# EAGLE design 4BitCounter (EAGLE 7.6.0)
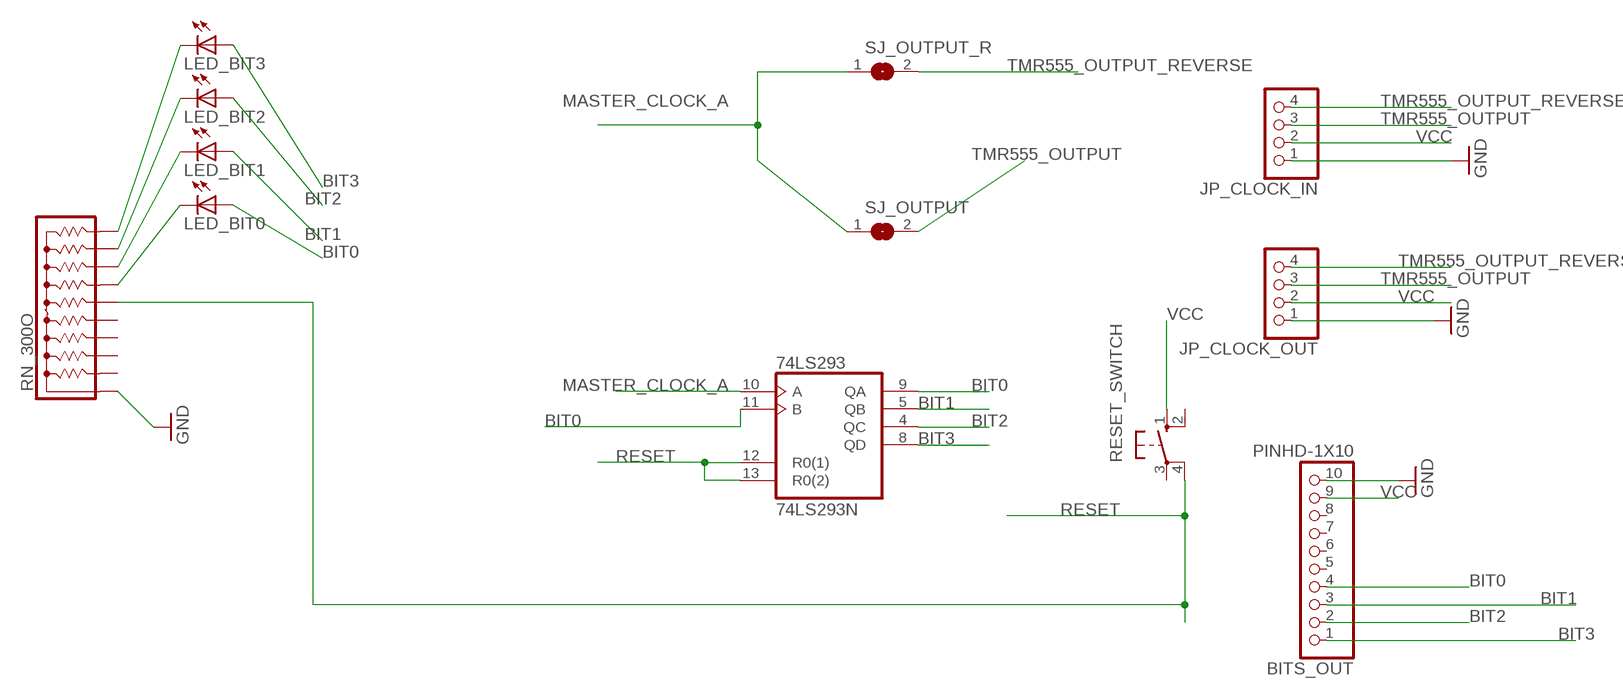
[diagram p0: schematic, sheet 1]

## Parts
74LS293  74LS293N  [DIL14]
BITS_OUT  PINHD-1X10  [1X10-BIG]
JP_CLOCK_IN  PINHD-1X4  [1X04]
JP_CLOCK_OUT  PINHD-1X4  [1X04]
LED_BIT0  LEDSMT1206  [1206]
LED_BIT1  LEDSMT1206  [1206]
LED_BIT2  LEDSMT1206  [1206]
LED_BIT3  LEDSMT1206  [1206]
RESET_SWITCH  10-XX  [B3F-10XX]
RN_300O  4610X  [SIP10]
SJ_OUTPUT  SOLDERJUMPERREFLOW  [SOLDERJUMPER_REFLOW]
SJ_OUTPUT_R  SOLDERJUMPERREFLOW  [SOLDERJUMPER_REFLOW]

## Nets
BIT0: 74LS293.9(QA) 74LS293.11(B) BITS_OUT.4 LED_BIT0.A
BIT1: 74LS293.5(QB) BITS_OUT.3 LED_BIT1.A
BIT2: 74LS293.4(QC) BITS_OUT.2 LED_BIT2.A
BIT3: 74LS293.8(QD) BITS_OUT.1 LED_BIT3.A
GND: BITS_OUT.10 JP_CLOCK_IN.1 JP_CLOCK_OUT.1 RN_300O.1
MASTER_CLOCK_A: 74LS293.10(A) SJ_OUTPUT.1 SJ_OUTPUT_R.1
N$1: LED_BIT1.C RN_300O.8
N$2: LED_BIT0.C RN_300O.7
N$3: LED_BIT2.C RN_300O.9
N$4: LED_BIT3.C RN_300O.10
RESET: 74LS293.12(R0(1)) 74LS293.13(R0(2)) RESET_SWITCH.4(P1) RN_300O.6
TMR555_OUTPUT: JP_CLOCK_IN.3 JP_CLOCK_OUT.3 SJ_OUTPUT.2
TMR555_OUTPUT_REVERSE: JP_CLOCK_IN.4 JP_CLOCK_OUT.4 SJ_OUTPUT_R.2
VCC: BITS_OUT.9 JP_CLOCK_IN.2 JP_CLOCK_OUT.2 RESET_SWITCH.1(S)
Unconnected: BITS_OUT.5 BITS_OUT.6 BITS_OUT.7 BITS_OUT.8 RESET_SWITCH.2(S1) RESET_SWITCH.3(P) RN_300O.2 RN_300O.3 RN_300O.4 RN_300O.5

## Power pins joined to a net without a drawn wire
GND: 74LS293.7(GND)
VCC: 74LS293.14(VCC)

## Library data of the parts
74LS293 = 74xx-eu:74*293: Decade and 4-bit BINARY COUNTER
BITS_OUT = adafruit:PINHD-1X10: Pin header 1x10 0.1" spacing With round pins
JP_CLOCK_IN JP_CLOCK_OUT = pinhead:PINHD-1X4: PIN HEADER
LED_BIT0 LED_BIT1-LED_BIT3 = adafruit:LED: LED OSRAM: - CHIPLED LG R971, LG N971, LY N971, LG Q971, LY Q971, LO R971, LY R971 LH N974, LH R974 LS Q976, LO Q976, LY Q976 LO Q996 - Hyper CHIPLED LW Q18S LB Q993, LB Q99A, LB R99A - SideLED LS A670, LO A670, LY A670, LG A670, LP A670 LB A673, LV A673, LT A673, LW A673 LH A674 LY A675 LS A676, LA A676, LO A676, LY A676, LW A676 LS A679, LY A679, LG A679 - Hyper Micro SIDELED® LS Y876, LA Y876, LO Y876, LY Y876 LT Y87S - SmartLED LW L88C, LW L88S LB L89C, LB L89S, LG L890 LS L89K, LO L89K, LY L89K LS L896, LA L896, LO L896, LY L896 - TOPLED LS T670, LO T670, LY T670, LG T670, LP T670 LSG T670, LSP T670, LSY T670, LOP T670, LYG T670 LG T671, LOG T671, LSG T671 LB T673, LV T673, LT T673, LW T673 LH T674 LS T676, LA T676, LO T676, LY T676, LB T676, LH T676, LSB T676, LW T676 LB T67C, LV T67C, LT T67C, LS T67K, LO T67K, LY T67K, LW E67C LS E67B, LA E67B, LO E67B, LY E67B, LB E67C, LV E67C, LT E67C LW T67C LS T679, LY T679, LG T679 LS T770, LO T770, LY T770, LG T770, LP T770 LB T773, LV T773, LT T773, LW T773 LH T774 LS E675, LA E675, LY E675, LS T675 LS T776, LA T776, LO T776, LY T776, LB T776 LHGB T686 LT T68C, LB T68C - Hyper Mini TOPLED® LB M676 - Mini TOPLED Santana® LG M470 LS M47K, LO M47K, LY M47K Source: http://www.osram.convergy.de/
RESET_SWITCH = switch-omron:10-XX: OMRON SWITCH; MPN: B3F-1000; OC_FARNELL: 176432; OC_NEWARK: 36M3542
RN_300O = resistor-sip:4610X: Bourns 4600X Series - Thick Film Conformal SIPs 4610X-101 Resistor Network Configuration: 101 (Bussed Resistors) Resistance range: 10 ohms to 10 Megaohms Maximum Operating Voltage: 100V Source: http://www.bourns.com/ProductLine.aspx?name=standard_thick_film_networks PDF: http://www.bourns.com/data/global/pdfs/4600X.pdf
SJ_OUTPUT SJ_OUTPUT_R = microbuilder:SOLDERJUMPER: SMD Solder JUMPER Solder the two pads together to create a connection, or remove the solder to break it. REFLOW - Use this footprint for solder paste and reflow ovens. WAVE - Use this footprint for hand-soldering (larger pads). CLOSED - Has a trace between the two pads to ensure it is closed by default. The trace needs to be cut to disable the jumper, and can be closed again by creating a solder bridge between the two pads.

## Board
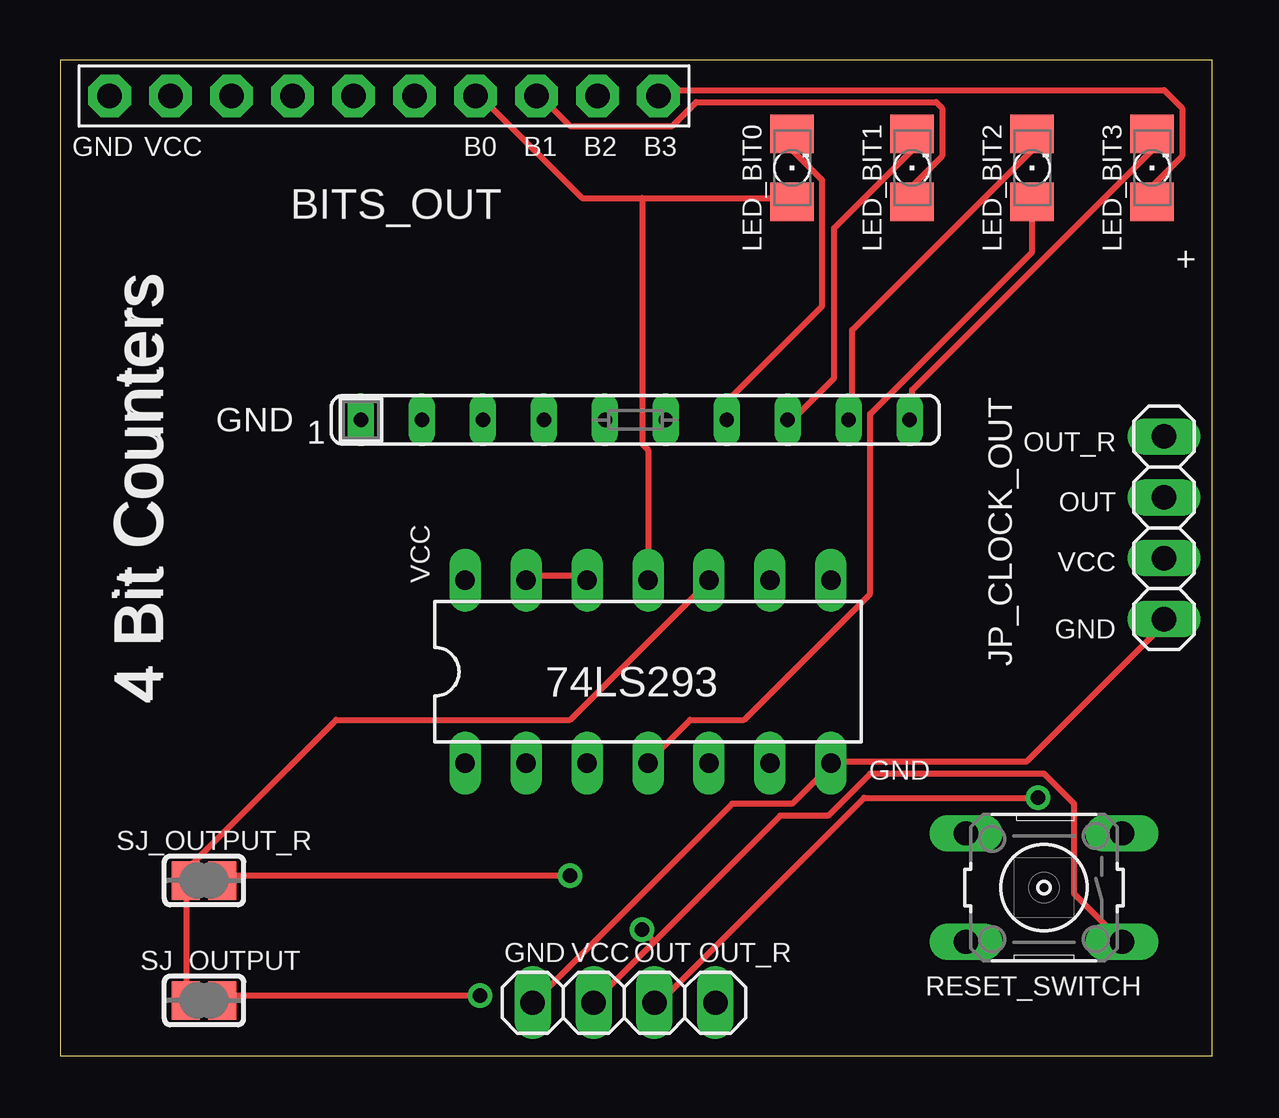
[diagram p1: board, top side]
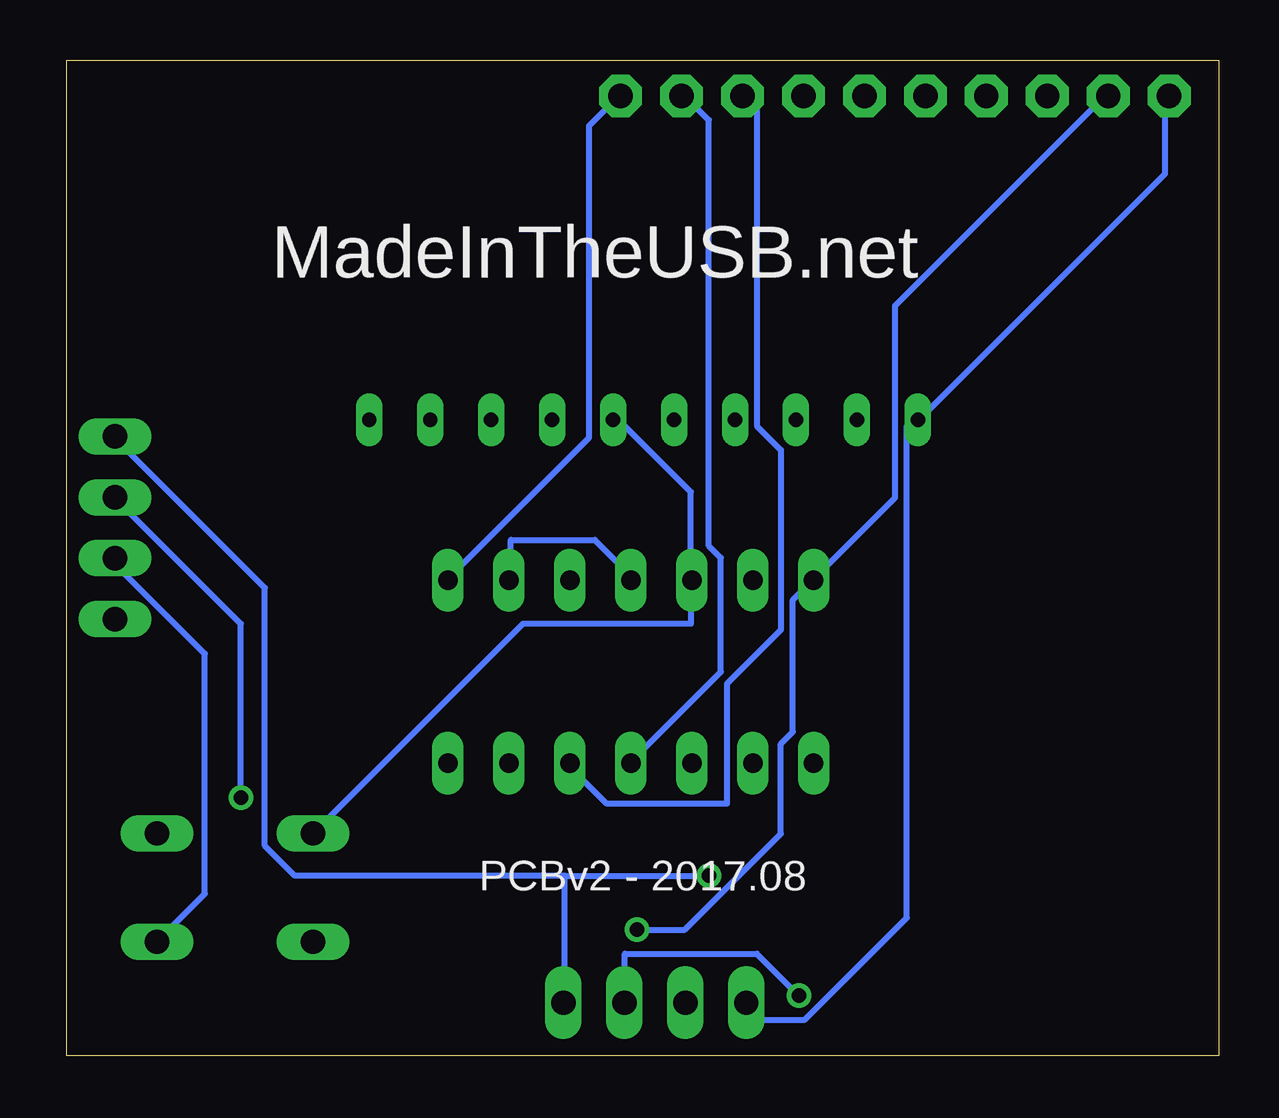
[diagram p2: board, bottom side, seen from below]

Size 48 x 41.5 mm. Coordinates in mm from the lower left corner, seen from the top.
Outline: 0,0 48,0 48,41.5 0,41.5 0,0
Copper layers (1*16): Top 0.035mm / dielectric 1.5mm / Bottom 0.035mm
Design rules "default": minimum track width 10mil, minimum drill 24mil, track to track 8mil, track to pad 8mil, pad to pad 8mil, via to via 8mil, smd to smd 8mil, copper to edge 40mil, drill to drill 8mil, minimum pad ring 10mil, minimum via ring 8mil, stop-mask expansion 4mil, vias tented up to drill 0mil, thermal gap 10mil

### Footprints (pad centres in the part's own frame; a part is rotated, then mirrored left to right if it is on the bottom)
DIL14 = drill 0.813 long: 1 -7.62,-3.81; 2 -5.08,-3.81; 3 -2.54,-3.81; 4 0,-3.81; 5 2.54,-3.81; 6 5.08,-3.81; 7 7.62,-3.81; 8 7.62,3.81; 9 5.08,3.81; 10 2.54,3.81; 11 0,3.81; 12 -2.54,3.81; 13 -5.08,3.81; 14 -7.62,3.81
1X10-BIG = drill 1.016 pad 1.778 octagon: 1 -11.43,0; 2 -8.89,0; 3 -6.35,0; 4 -3.81,0; 5 -1.27,0; 6 1.27,0; 7 3.81,0; 8 6.35,0; 9 8.89,0; 10 11.43,0
1X04 = drill 1.016 long: 1 -3.81,0; 2 -1.27,0; 3 1.27,0; 4 3.81,0
1206 = smd 1.6 x 1.803: A -1.422,0; C 1.422,0
B3F-10XX = drill 1.016 long: 1 -3.251,2.261; 2 3.251,2.261; 3 -3.251,-2.261; 4 3.251,-2.261
SIP10 = drill 0.6 long: 1 -11.46,0; 2 -8.92,0; 3 -6.38,0; 4 -3.84,0; 5 -1.3,0; 6 1.24,0; 7 3.78,0; 8 6.32,0; 9 8.86,0; 10 11.4,0
SOLDERJUMPER_REFLOW = smd 1.168 x 1.6: 1 -0.762,0; 2 0.762,0

### Placement (x,y rotation side)
74LS293  24.5,16 0 top
BITS_OUT  13.5,40 180 top
JP_CLOCK_IN  23.5,2.2 0 top
JP_CLOCK_OUT  46,22 90 top
LED_BIT0  30.5,37 90 top
LED_BIT1  35.5,37 90 top
LED_BIT2  40.5,37 90 top
LED_BIT3  45.5,37 90 top
RESET_SWITCH  41,7 180 top
RN_300O  24,26.5 0 top
SJ_OUTPUT  6,2.3 0 top
SJ_OUTPUT_R  6,7.3 0 top

### Tracks (layer width: path | path; a pad name or v marks a point on that pad's centre or on a via)
BIT0
  Top 0.254: 24.25,35.75 21.75,35.75 17.5,40 BITS_OUT.4 | 24.25,35.75 30.5,35.75 LED_BIT0.A | 74LS293.11 24.5,25.25 24.25,25.5 24.25,35.75
  Bottom 0.254: 74LS293.11 24.5,20 26,21.5 29.5,21.5 29.5,20 74LS293.9
BIT1
  Top 0.254: LED_BIT1.A 35.5,36.25 36.75,37.5 36.75,39.5 36.5,39.75 26.5,39.75 25.5,38.75 21.25,38.75 20,40 BITS_OUT.3
  Bottom 0.254: 74LS293.5 27,12 25.5,10.5 20.5,10.5 20.5,15.5 18.25,17.75 18.25,25.25 19.25,26.25 19.25,39.5 19.75,40 BITS_OUT.3
BIT2
  Top 0.254: LED_BIT2.A 40.5,33.5 33.75,26.75 33.75,19.25 28.5,14 26.25,14 24.5,12.25 74LS293.4
  Bottom 0.254: BITS_OUT.2 22.25,40 21.25,39 21.25,21.25 20.75,20.75 20.75,16 24.5,12.25 74LS293.4
BIT3
  Top 0.254: LED_BIT3.A 45.5,36.25 46.75,37.5 46.75,39.5 46,40.25 25.25,40.25 25,40 BITS_OUT.1
  Bottom 0.254: 74LS293.8 32,20 26.25,25.75 26.25,38.75 25,40 BITS_OUT.1
GND
  Top 0.254: JP_CLOCK_OUT.1 46,18 40.25,12.25 32.25,12.25 74LS293.7 32,12 30.5,10.5 28,10.5 19.75,2.25 JP_CLOCK_IN.1
  Bottom 0.254: BITS_OUT.10 2.25,40 2.25,36.75 12.5,26.5 RN_300O.1 12.75,26.5 13,26.25 13,5.75 17.25,1.5 19.5,1.5 19.5,2 JP_CLOCK_IN.1
MASTER_CLOCK_A
  Top 0.254: SJ_OUTPUT.1 5.25,2.5 5.25,7.25 SJ_OUTPUT_R.1 5,7.5 11.5,14 21.25,14 27,19.75 74LS293.10
N$1
  Top 0.254: LED_BIT1.C 35.5,37.75 32.25,34.5 32.25,28.25 30.5,26.5 RN_300O.8
N$2
  Top 0.254: LED_BIT0.C 30.5,37.75 31.75,36.5 31.75,31.25 28,27.5 28,26.5 RN_300O.7
N$3
  Top 0.254: LED_BIT2.C 40.5,37.75 33,30.25 33,26.5 RN_300O.9
N$4
  Top 0.254: LED_BIT3.C 45.5,37.75 35.5,27.75 35.5,26.5 RN_300O.10
RESET
  Top 0.254: 74LS293.13 19.5,20 21.75,20 74LS293.12
  Bottom 0.254: RN_300O.6 25,26.5 22,23.5 22,20 74LS293.12 22,19.75 22,18 29,18 37.5,9.5 RESET_SWITCH.4
TMR555_OUTPUT  (via drill 0.61)
  Top 0.254: v17.5,2.5 7,2.5 SJ_OUTPUT.2 | v40.75,10.75 33.5,10.75 25,2.25 JP_CLOCK_IN.3
  Bottom 0.254: v17.5,2.5 19.25,4.25 24.75,4.25 24.75,2.25 JP_CLOCK_IN.3 | v40.75,10.75 40.75,18 46,23.25 JP_CLOCK_OUT.3
TMR555_OUTPUT_REVERSE  (via drill 0.61)
  Top 0.254: v21.25,7.5 7,7.5 SJ_OUTPUT_R.2
  Bottom 0.254: 27.25,7.5 v21.25,7.5 | 27.25,7.5 27.25,2.25 JP_CLOCK_IN.4 | 27.25,7.5 38.5,7.5 39.75,8.75 39.75,19.5 46,25.75 JP_CLOCK_OUT.4
VCC  (via drill 0.61)
  Top 0.254: 24.75,4.75 30,10 32,10 33.75,11.75 41,11.75 42.25,10.5 42.25,6.75 RESET_SWITCH.1 | 24.75,4.75 22.25,2.25 JP_CLOCK_IN.2 | 24.75,4.75 v24.25,5.25
  Bottom 0.254: BITS_OUT.9 4.75,40 13.5,31.25 13.5,23.25 16.75,20 74LS293.14 17,19.75 17.75,19 17.75,13.5 18.25,13 18.25,9.25 22.25,5.25 v24.25,5.25 | JP_CLOCK_OUT.2 46,20.5 42.25,16.75 42.25,6.75 RESET_SWITCH.1

### Text on the board
tNames: GND | VCC | B0 | B1 | B2 | B3 | + | GND | OUT_R | 4 Bit Counters | 4 Bit Counters | OUT | VCC | VCC | GND | GND | GND | VCC | OUT | OUT_R
bNames: MadeInTheUSB.net | PCBv2 - 2017.08